# EAGLE schematic E-P-206-R1.2 Fuel Cell Control (Board to Board) (EAGLE 7.4.0)

## Sheet 1 of 4: Connectors
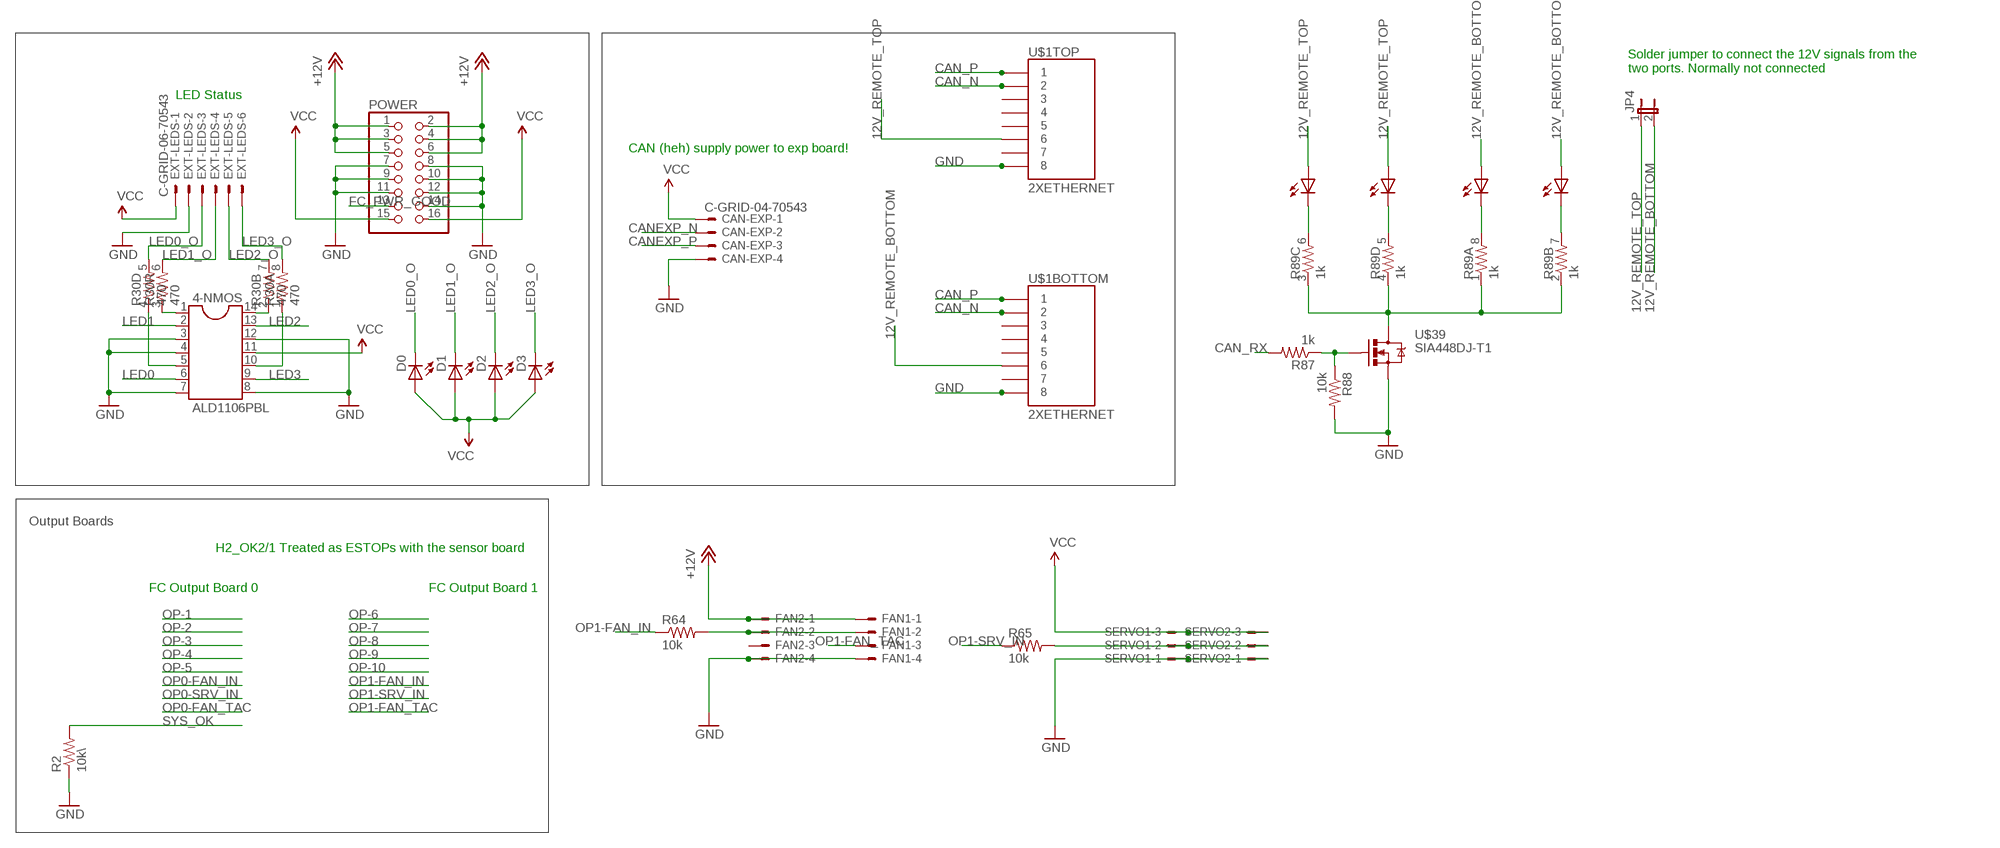
[diagram p0: schematic, sheet 1]

### Parts
4-NMOS  ALD1106PBL  DIL14SOIC  [SOIC-14]
CAN-EXP  C-GRID-04-70543  [70543-04]
D0  LED1206  [LED-1206]
D1  LED1206  [LED-1206]
D2  LED1206  [LED-1206]
D3  LED1206  [LED-1206]
EXT-LEDS  C-GRID-06-70543  [70543-06]
FAN1  C-GRID-04-70543  [70543-04]
FAN2  C-GRID-04-70543  [70543-04]
JP4  JUMPER-2SMD-NO  [SJ_2S-NO]
POWER  PINHD-2X8  [2X08]
R2  10k\  RESISTOR0603-RES  [0603-RES]
R30  470  RESISTOR-ARRAY0603-ARV  [0603-ARV]
R64  10k  RESISTOR0603-RES  [0603-RES]
R65  10k  RESISTOR0603-RES  [0603-RES]
R87  1k  RESISTOR0603-RES  [0603-RES]
R88  10k  RESISTOR0603-RES  [0603-RES]
R89  1k  RESISTOR-ARRAY0603-ARV  [0603-ARV]
SERVO1  C-GRID-03-70543  [70543-03]
SERVO2  C-GRID-03-70543  [70543-03]
U$1  2XETHERNET  [2XETHERNET]
U$39  SIA448DJ-T1  SIA426DJ  [SC70-6L]

### Nets
12V_REMOTE_BOTTOM: JP4.2 U$1.B_6 U$1.B_9(BTM_LED_0:A) U$1.B_11(BTM_LED_1:A)
12V_REMOTE_TOP: JP4.1 U$1.T_6 U$1.T_9(TOP_LED_0:A) U$1.T_11(TOP_LED_1:A)
+12V: FAN1.1 FAN2.1 POWER.1 POWER.2 POWER.3 POWER.4 POWER.5 POWER.6 ; also sheet 2,3,4
CAN_N: U$1.B_2 U$1.T_2 ; also sheet 3
CAN_P: U$1.B_1 U$1.T_1 ; also sheet 3
CAN_RX: R87.2 ; also sheet 3
CANEXP_N: CAN-EXP.2 ; also sheet 3
CANEXP_P: CAN-EXP.3 ; also sheet 3
FC_PWR_GOOD: POWER.13 ; also sheet 3
GND: 4-NMOS.3 4-NMOS.4 4-NMOS.7 4-NMOS.8 4-NMOS.12 CAN-EXP.4 EXT-LEDS.2 FAN1.4 FAN2.4 POWER.7 POWER.8 POWER.9 POWER.10 POWER.11 POWER.12 POWER.14 R2.1 R88.2 SERVO1.1 SERVO2.1 U$1.B_8 U$1.T_8 U$39.S@0(S) U$39.S@1(S) ; also sheet 2,3,4
LED0: 4-NMOS.6 ; also sheet 3
LED0_O: D0.C EXT-LEDS.3 R30.5
LED1: 4-NMOS.2 ; also sheet 3
LED1_O: D1.C EXT-LEDS.4 R30.6
LED2: 4-NMOS.13 ; also sheet 3
LED2_O: D2.C EXT-LEDS.5 R30.7
LED3: 4-NMOS.9 ; also sheet 3
LED3_O: D3.C EXT-LEDS.6 R30.8
N$2: 4-NMOS.5 R30.4
N$4: 4-NMOS.1 R30.3
N$7: 4-NMOS.14 R30.2
N$8: 4-NMOS.10 R30.1
N$15: R89.7 U$1.B_10(BTM_LED_0:C)
N$17: R89.5 U$1.T_12(TOP_LED_1:C)
N$18: R87.1 R88.1 U$39.G
N$19: R89.6 U$1.T_10(TOP_LED_0:C)
N$20: R89.8 U$1.B_12(BTM_LED_1:C)
N$36: FAN1.2 FAN2.2 R64.2
N$37: R65.2 SERVO1.2 SERVO2.2
N$86: R89.1 R89.2 R89.3 R89.4 U$39.D
OP1-FAN_IN: R64.1 ; also sheet 3
OP1-FAN_TAC: FAN1.3 ; also sheet 3
OP1-SRV_IN: R65.1 ; also sheet 3
SYS_OK: R2.2 ; also sheet 2,3
VCC: 4-NMOS.11 CAN-EXP.1 D0.A D1.A D2.A D3.A EXT-LEDS.1 POWER.15 POWER.16 SERVO1.3 SERVO2.3 ; also sheet 2,3
Unconnected: FAN2.3 U$1.B_3 U$1.B_4 U$1.B_5 U$1.B_7 U$1.T_3 U$1.T_4 U$1.T_5 U$1.T_7

### Notes on the sheet
- Solder jumper to connect the 12V signals from the
  two ports. Normally not connected
- LED Status
- CAN (heh) supply power to exp board!
- Output Boards
- H2_OK2/1 Treated as ESTOPs with the sensor board
- FC Output Board 0 | FC Output Board 1

## Sheet 2 of 4: Sensors
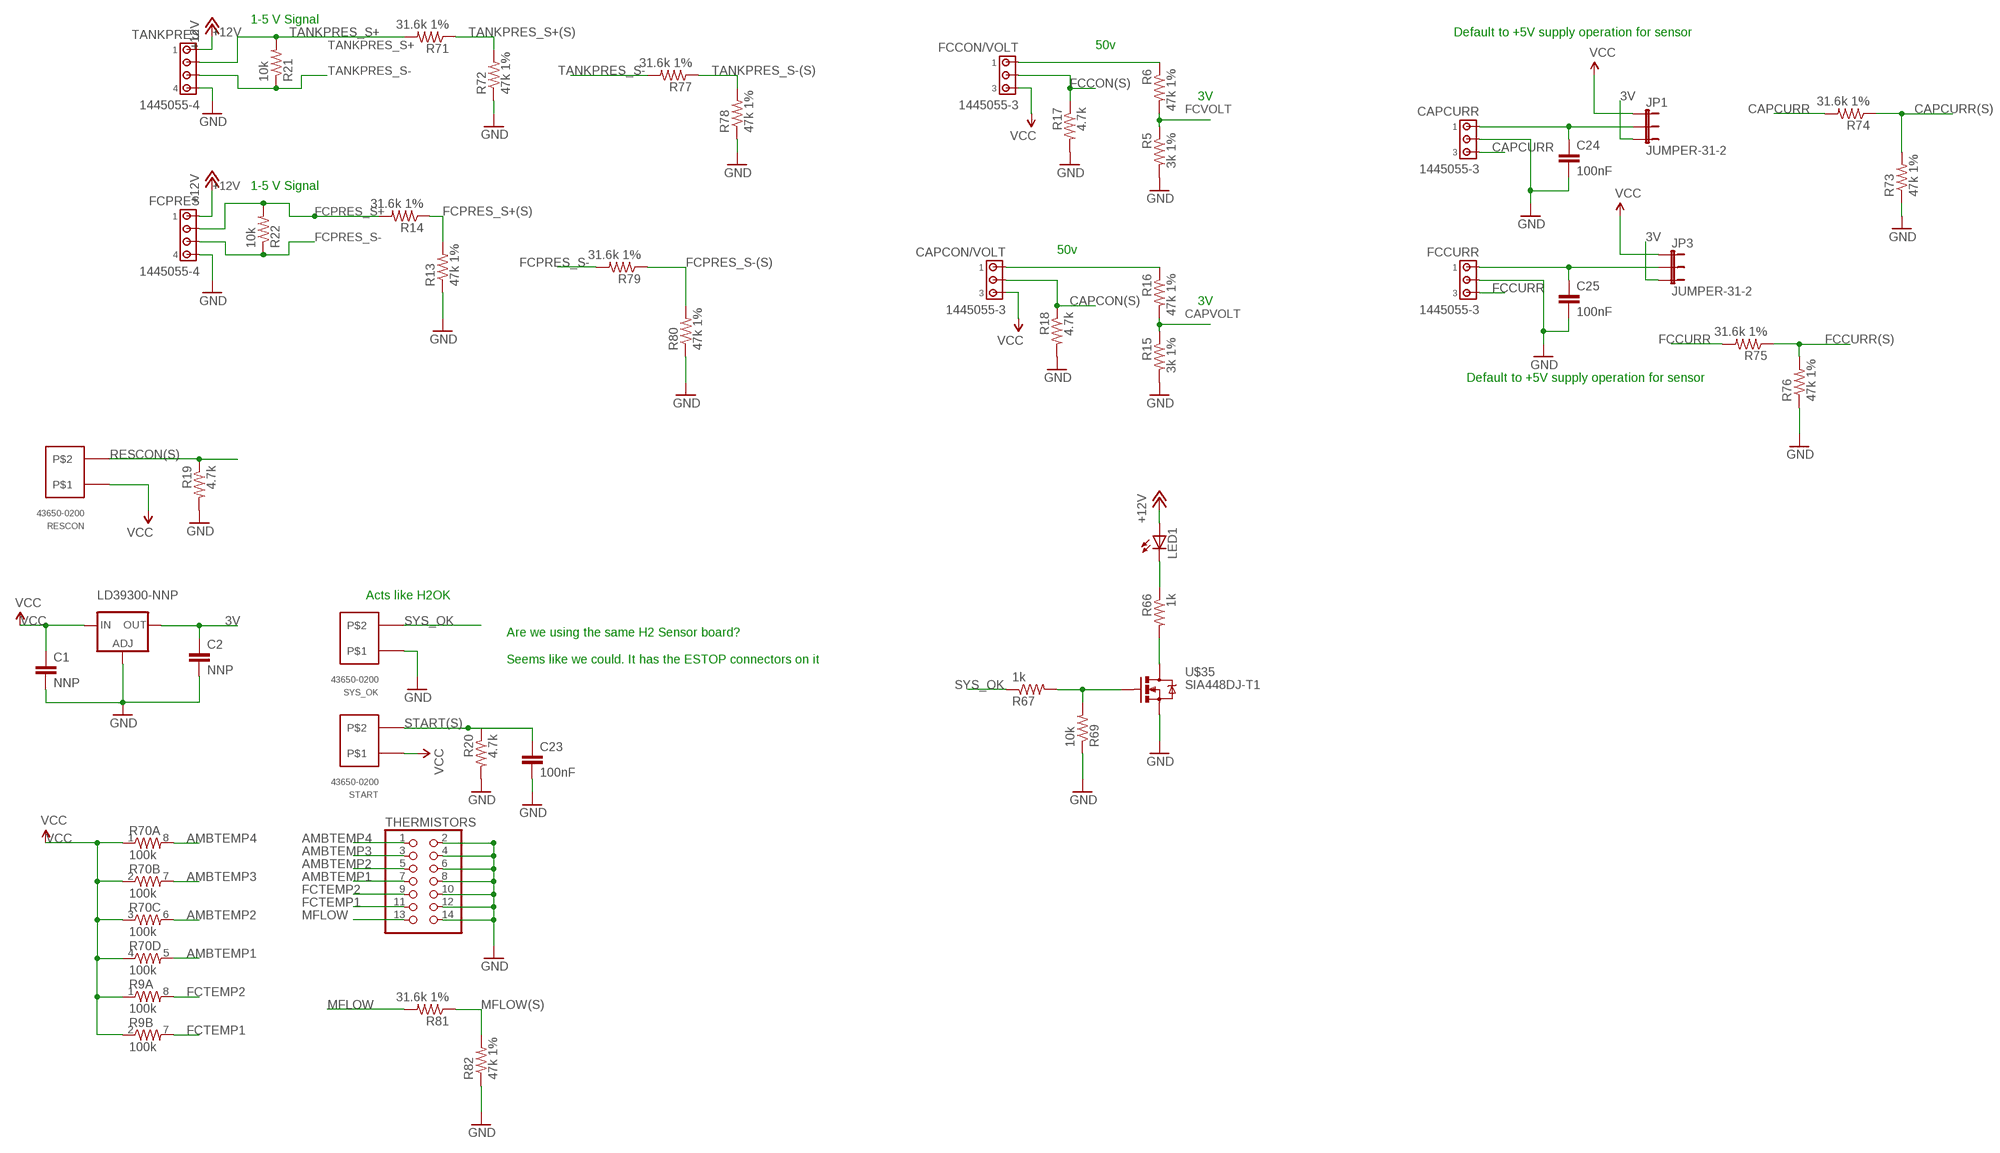
[diagram p1: schematic, sheet 2]

### Parts
C1  NNP  CAP1206  [1206]
C2  NNP  CAP1206  [1206]
C23  100nF  CAP0603-CAP  [0603-CAP]
C24  100nF  CAP0603-CAP  [0603-CAP]
C25  100nF  CAP0603-CAP  [0603-CAP]
CAPCON/VOLT  1445055-3  [1445055-3]
CAPCURR  1445055-3  [1445055-3]
FCCON/VOLT  1445055-3  [1445055-3]
FCCURR  1445055-3  [1445055-3]
FCPRES  1445055-4  [1445055-4]
JP1  JUMPER-31-2  [SJ_3_PASTE1&2]
JP3  JUMPER-31-2  [SJ_3_PASTE1&2]
LD39300-NNP  LD117ADT50TR  [DPACK]
LED1  LED1206  [LED-1206]
R5  3k 1%  RESISTOR0603-RES  [0603-RES]
R6  47k 1%  RESISTOR0603-RES  [0603-RES]
R9  100k  RESISTOR-ARRAY0603-ARV  [0603-ARV]
R13  47k 1%  RESISTOR0603-RES  [0603-RES]
R14  31.6k 1%  RESISTOR0603-RES  [0603-RES]
R15  3k 1%  RESISTOR0603-RES  [0603-RES]
R16  47k 1%  RESISTOR0603-RES  [0603-RES]
R17  4.7k  RESISTOR0603-RES  [0603-RES]
R18  4.7k  RESISTOR0603-RES  [0603-RES]
R19  4.7k  RESISTOR0603-RES  [0603-RES]
R20  4.7k  RESISTOR0603-RES  [0603-RES]
R21  10k  RESISTOR0603-RES  [0603-RES]
R22  10k  RESISTOR0603-RES  [0603-RES]
R66  1k  RESISTOR0603-RES  [0603-RES]
R67  1k  RESISTOR0603-RES  [0603-RES]
R69  10k  RESISTOR0603-RES  [0603-RES]
R70  100k  RESISTOR-ARRAY0603-ARV  [0603-ARV]
R71  31.6k 1%  RESISTOR0603-RES  [0603-RES]
R72  47k 1%  RESISTOR0603-RES  [0603-RES]
R73  47k 1%  RESISTOR0603-RES  [0603-RES]
R74  31.6k 1%  RESISTOR0603-RES  [0603-RES]
R75  31.6k 1%  RESISTOR0603-RES  [0603-RES]
R76  47k 1%  RESISTOR0603-RES  [0603-RES]
R77  31.6k 1%  RESISTOR0603-RES  [0603-RES]
R78  47k 1%  RESISTOR0603-RES  [0603-RES]
R79  31.6k 1%  RESISTOR0603-RES  [0603-RES]
R80  47k 1%  RESISTOR0603-RES  [0603-RES]
R81  31.6k 1%  RESISTOR0603-RES  [0603-RES]
R82  47k 1%  RESISTOR0603-RES  [0603-RES]
RESCON  43650-0200  [43650-0200]
START  43650-0200  [43650-0200]
SYS_OK  43650-0200  [43650-0200]
TANKPRES  1445055-4  [1445055-4]
THERMISTORS  PINHD-2X7  [2X07]
U$35  SIA448DJ-T1  SIA426DJ  [SC70-6L]

### Nets
3V: C2.1 JP1.3 JP3.3 LD39300-NNP.4(OUT)
+12V: FCPRES.1 LED1.A TANKPRES.1 ; also sheet 1,3,4
AMBTEMP1: R70.5 THERMISTORS.7 ; also sheet 3
AMBTEMP2: R70.6 THERMISTORS.5 ; also sheet 3
AMBTEMP3: R70.7 THERMISTORS.3 ; also sheet 3
AMBTEMP4: R70.8 THERMISTORS.1 ; also sheet 3
CAPCON(S): CAPCON/VOLT.2 R18.1 ; also sheet 3
CAPCURR: CAPCURR.3 R74.2
CAPCURR(S): R73.2 R74.1 ; also sheet 3
CAPVOLT: R15.1 R16.2 ; also sheet 3
FCCON(S): FCCON/VOLT.2 R17.1 ; also sheet 3
FCCURR: FCCURR.3 R75.2
FCCURR(S): R75.1 R76.2 ; also sheet 3
FCPRES_S+: FCPRES.2 R14.2 R22.2
FCPRES_S+(S): R13.2 R14.1 ; also sheet 3
FCPRES_S-: FCPRES.3 R22.1 R79.2
FCPRES_S-(S): R79.1 R80.2 ; also sheet 3
FCTEMP1: R9.7 THERMISTORS.11 ; also sheet 3
FCTEMP2: R9.8 THERMISTORS.9 ; also sheet 3
FCVOLT: R5.1 R6.2 ; also sheet 3
FCVOLT+: FCCON/VOLT.1 R6.1
FCVOLT+1: CAPCON/VOLT.1 R16.1
GND: C1.2 C2.2 C23.2 C24.2 C25.2 CAPCURR.2 FCCURR.2 FCPRES.4 LD39300-NNP.1(ADJ) R5.2 R13.1 R15.2 R17.2 R18.2 R19.2 R20.2 R69.1 R72.1 R73.1 R76.1 R78.1 R80.1 R82.1 SYS_OK.P$2 TANKPRES.4 THERMISTORS.2 THERMISTORS.4 THERMISTORS.6 THERMISTORS.8 THERMISTORS.10 THERMISTORS.12 THERMISTORS.14 U$35.S@0(S) U$35.S@1(S) ; also sheet 1,3,4
MFLOW: R81.2 THERMISTORS.13
MFLOW(S): R81.1 R82.2 ; also sheet 3
N$54: R66.2 U$35.D
N$62: R67.2 R69.2 U$35.G
N$70: LED1.C R66.1
N$74: C24.1 CAPCURR.1 JP1.2
N$78: C25.1 FCCURR.1 JP3.2
RESCON(S): R19.1 RESCON.P$1 ; also sheet 3
START(S): C23.1 R20.1 START.P$1 ; also sheet 3
SYS_OK: R67.1 SYS_OK.P$1 ; also sheet 1,3
TANKPRES_S+: R21.2 R71.2 TANKPRES.2
TANKPRES_S+(S): R71.1 R72.2 ; also sheet 3
TANKPRES_S-: R21.1 R77.2 TANKPRES.3
TANKPRES_S-(S): R77.1 R78.2 ; also sheet 3
VCC: C1.1 CAPCON/VOLT.3 FCCON/VOLT.3 JP1.1 JP3.1 LD39300-NNP.3(IN) R9.1 R9.2 R70.1 R70.2 R70.3 R70.4 RESCON.P$2 START.P$2 ; also sheet 1,3
Unconnected: R9.3 R9.4 R9.5 R9.6

### Notes on the sheet
- 1-5 V Signal
- Default to +5V supply operation for sensor
- 50v
- 3V
- 1-5 V Signal
- 50v
- 3V
- Default to +5V supply operation for sensor
- Acts like H2OK
- Are we using the same H2 Sensor board? 
  
  Seems like we could. It has the ESTOP connectors on it

## Sheet 3 of 4: MCU
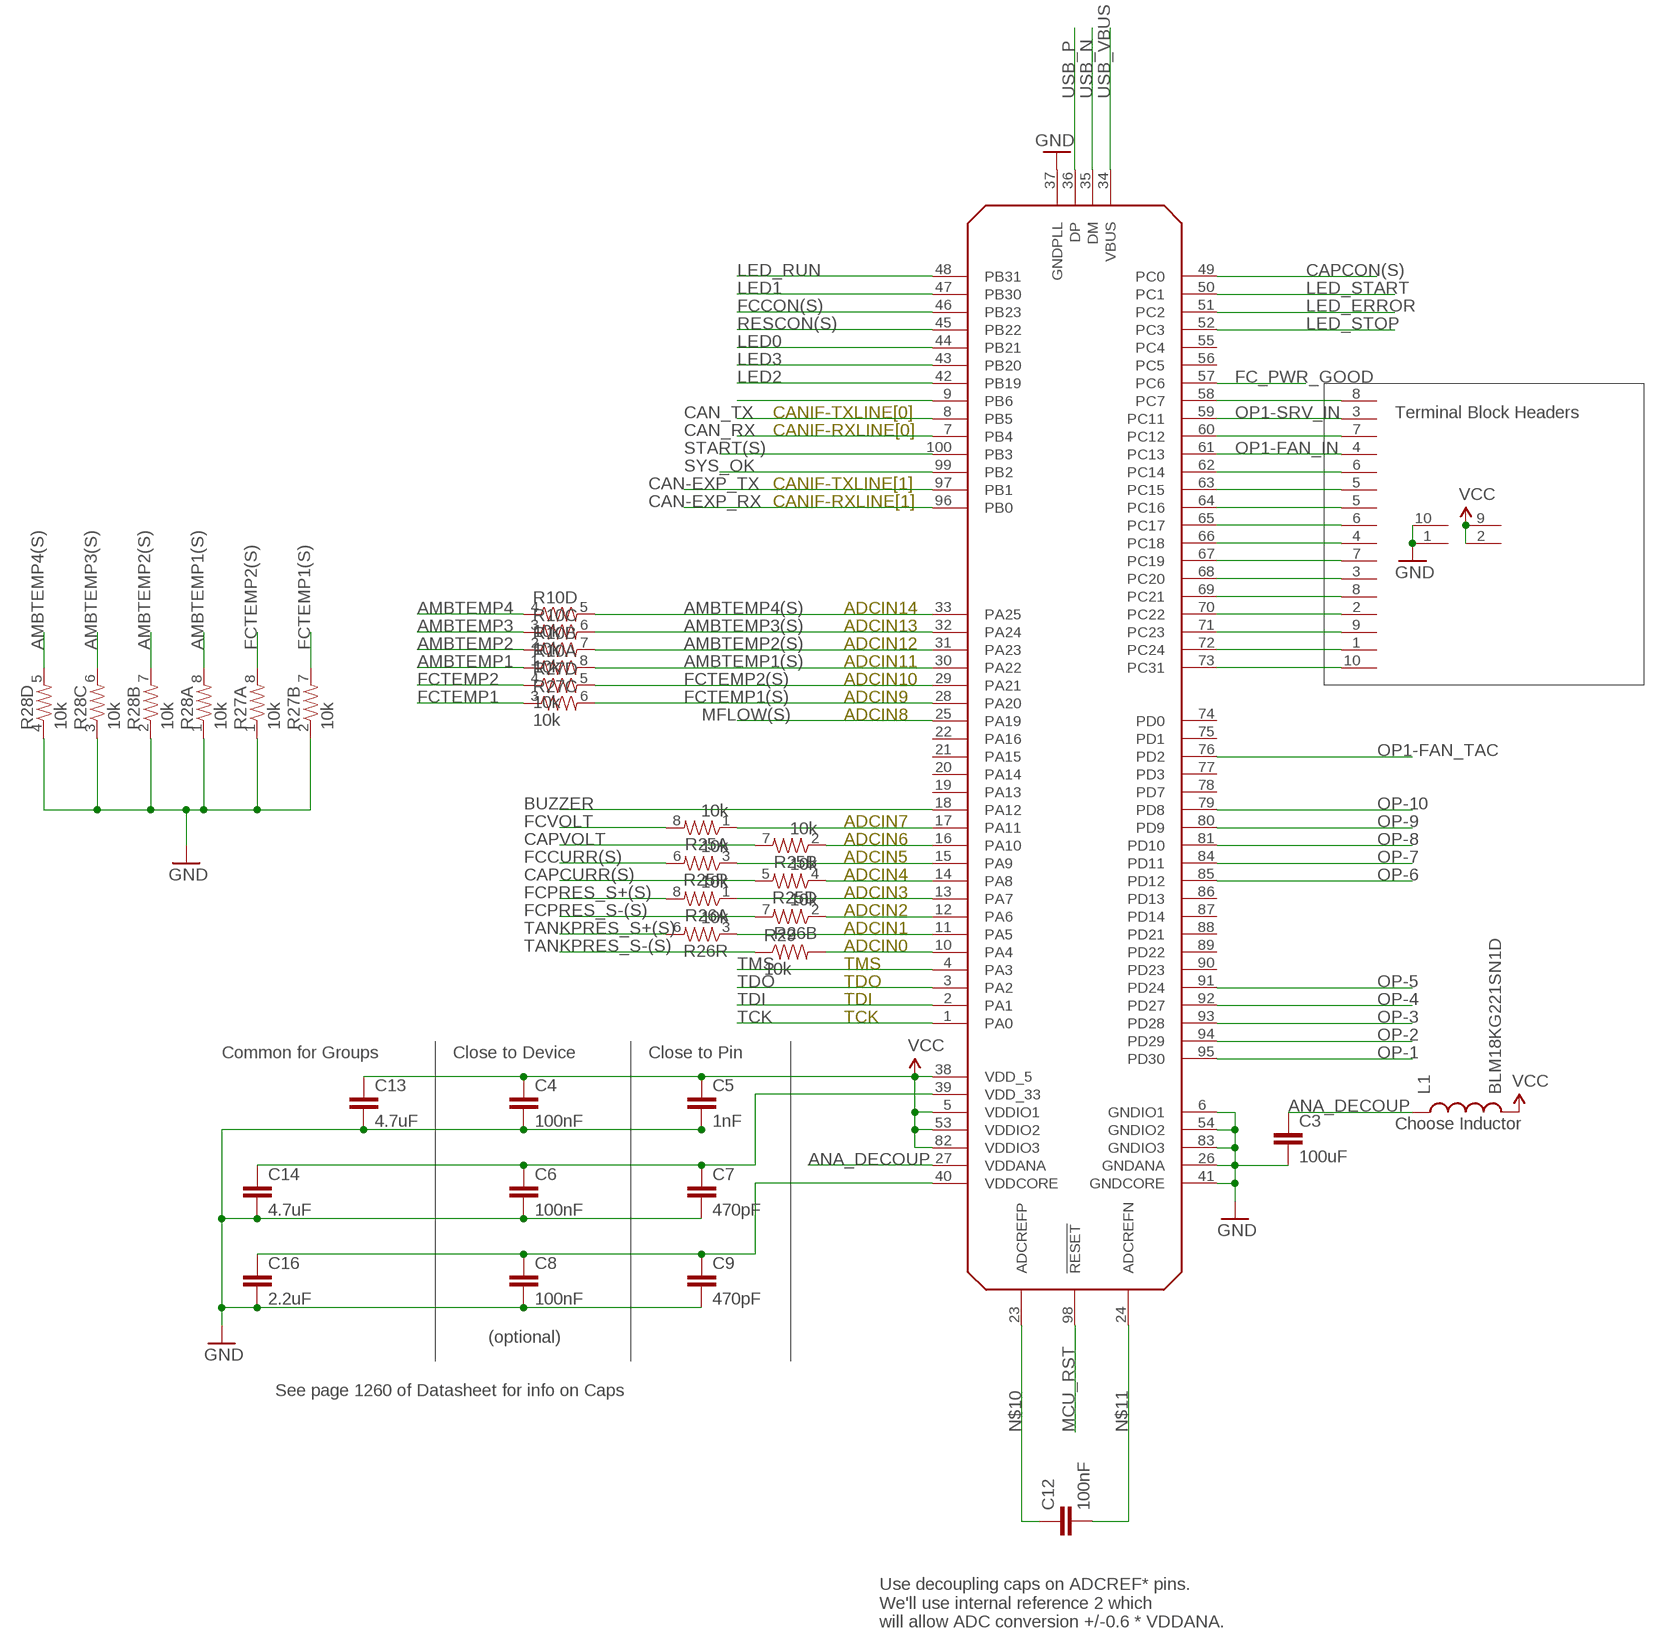
[diagram p2: schematic, sheet 3, part 1 of 2]
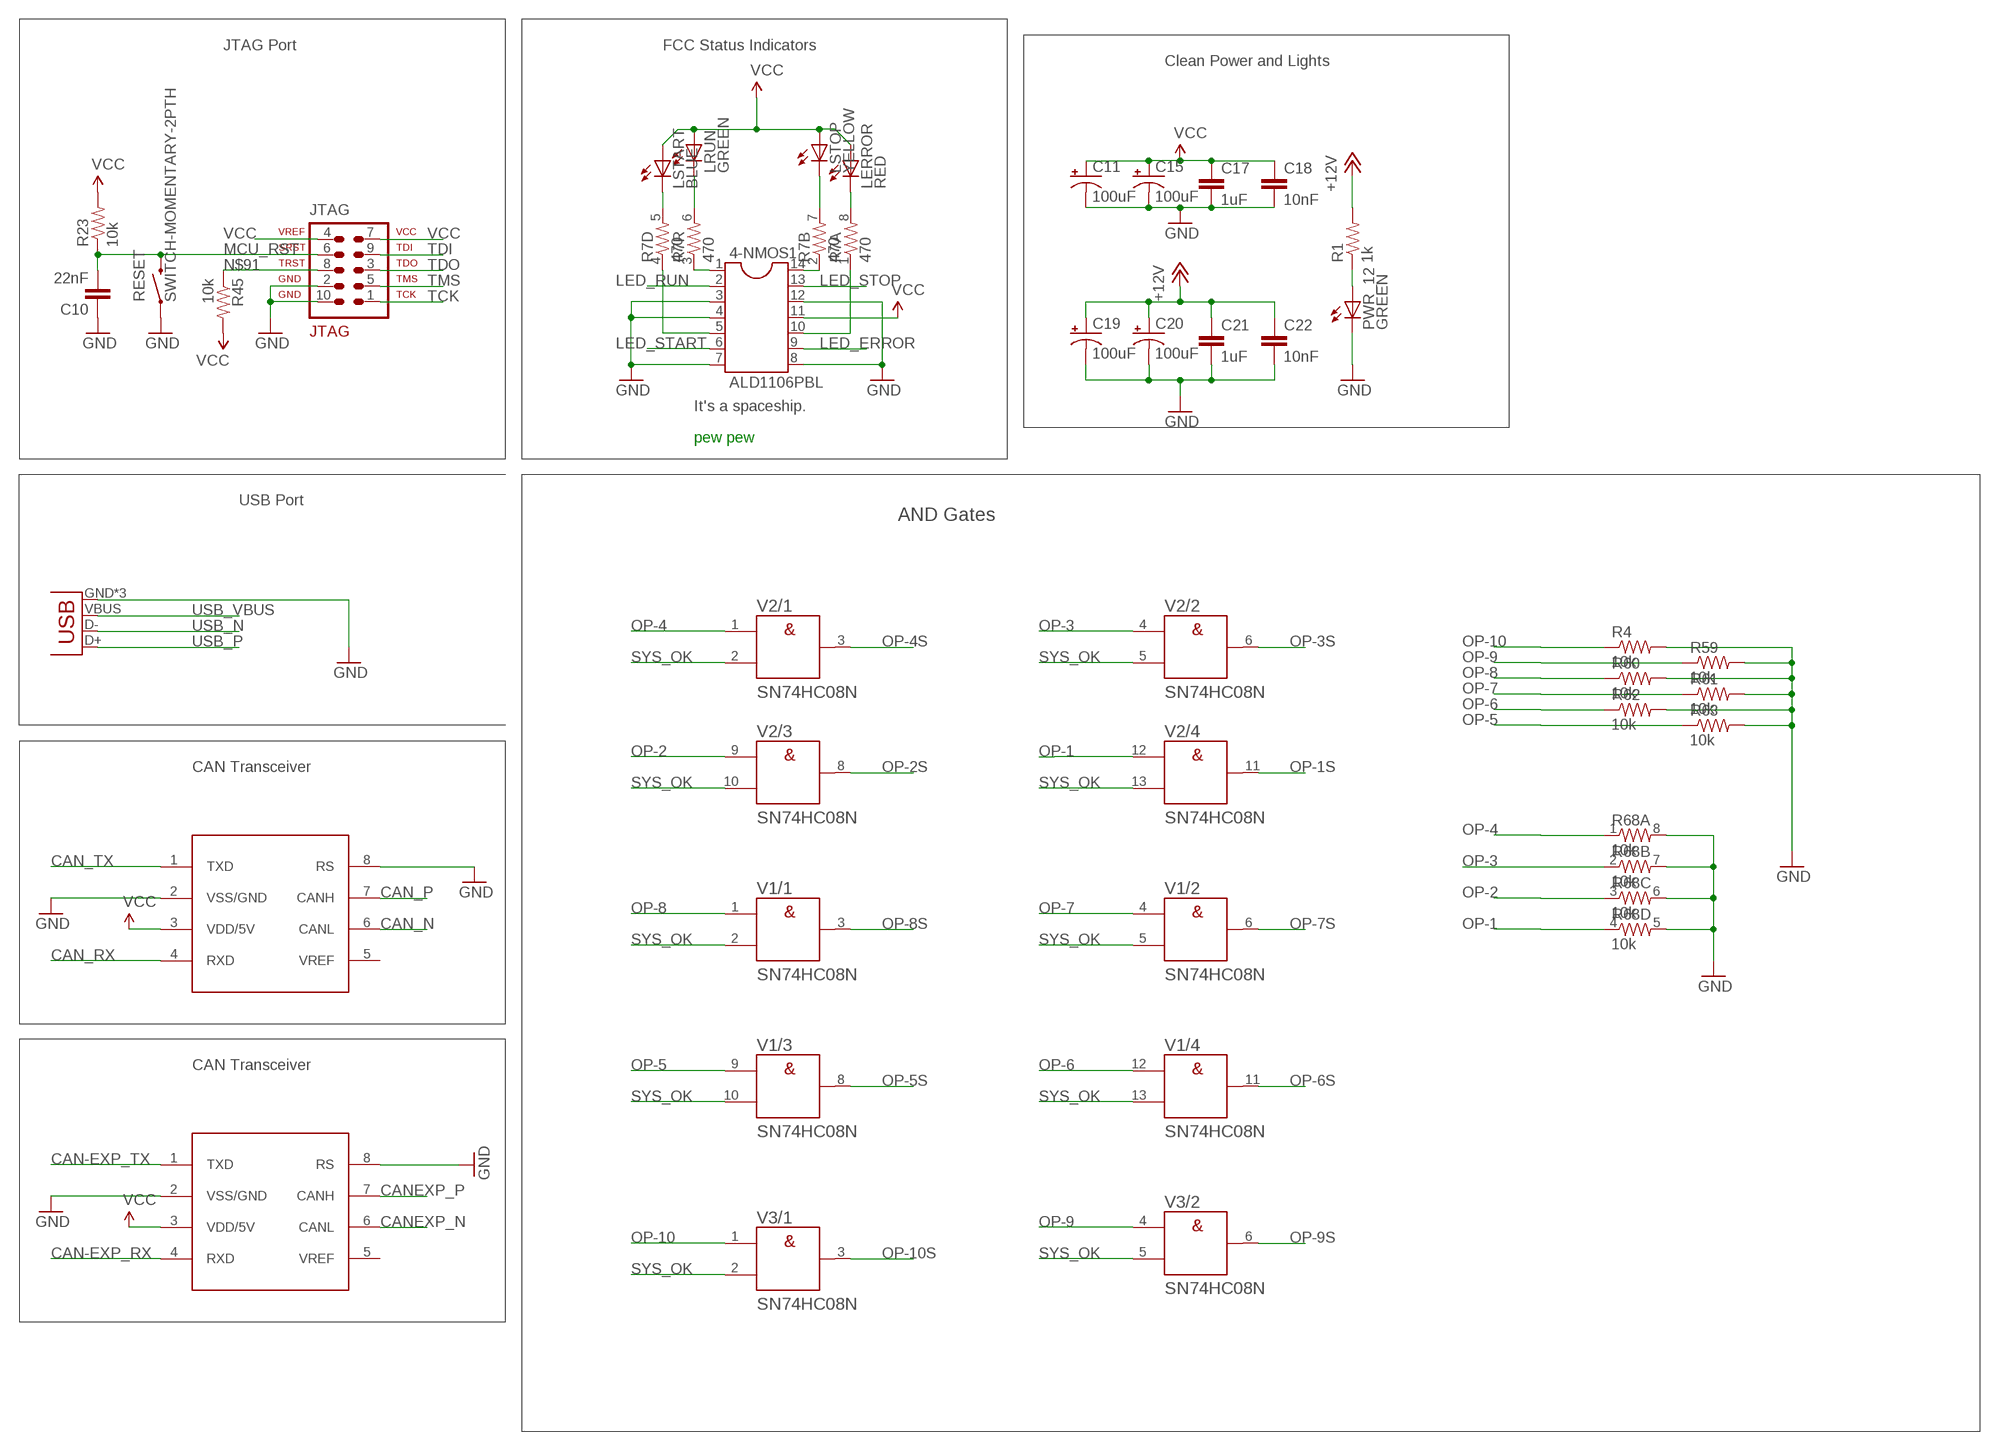
[diagram p3: schematic, sheet 3, part 2 of 2]

### Parts
4-NMOS1  ALD1106PBL  DIL14SOIC  [SOIC-14]
C3  100uF  CAP0805  [0805]
C4  100nF  CAP0603-CAP  [0603-CAP]
C5  1nF  CAP0603-CAP  [0603-CAP]
C6  100nF  CAP0603-CAP  [0603-CAP]
C7  470pF  CAP0603-CAP  [0603-CAP]
C8  100nF  CAP0603-CAP  [0603-CAP]
C9  470pF  CAP0603-CAP  [0603-CAP]
C10  22nF  CAP0603-CAP  [0603-CAP]
C11  100uF  CAP_POLC  [PANASONIC_C]
C12  100nF  CAP0805  [0805]
C13  4.7uF  CAP0805  [0805]
C14  4.7uF  CAP0805  [0805]
C15  100uF  CAP_POLC  [PANASONIC_C]
C16  2.2uF  CAP0805  [0805]
C17  1uF  CAP0805  [0805]
C18  10nF  CAP0603-CAP  [0603-CAP]
C19  100uF  CAP_POLC  [PANASONIC_C]
C20  100uF  CAP_POLC  [PANASONIC_C]
C21  1uF  CAP0805  [0805]
C22  10nF  CAP0603-CAP  [0603-CAP]
JP2  USB  USB-MICROB  [USB-MICROB]
JTAG  2x5  AVR-JTAG-10  [AVR-JTAG-10]
L1  BLM18KG221SN1D  INDUCTOR0603  [0603]
LERROR  RED  LED1206  [LED-1206]
LRUN  GREEN  LED1206  [LED-1206]
LSTART  BLUE  LED1206  [LED-1206]
LSTOP  YELLOW  LED1206  [LED-1206]
MCU  AT32UC3C1512  [TQFP100]
PWR_12  GREEN  LED1206  [LED-1206]
R1  1k  RESISTOR0603-RES  [0603-RES]
R4  10k  RESISTOR0603-RES  [0603-RES]
R7  470  RESISTOR-ARRAY0603-ARV  [0603-ARV]
R10  10k  RESISTOR-ARRAY0603-ARV  [0603-ARV]
R23  10k  RESISTOR0603-RES  [0603-RES]
R25  10k  RESISTOR-ARRAY0603-ARV  [0603-ARV]
R26  10k  RESISTOR-ARRAY0603-ARV  [0603-ARV]
R27  10k  RESISTOR-ARRAY0603-ARV  [0603-ARV]
R28  10k  RESISTOR-ARRAY0603-ARV  [0603-ARV]
R29  10k  RESISTOR0603-RES  [0603-RES]
R45  10k  RESISTOR0603-RES  [0603-RES]
R59  10k  RESISTOR0603-RES  [0603-RES]
R60  10k  RESISTOR0603-RES  [0603-RES]
R61  10k  RESISTOR0603-RES  [0603-RES]
R62  10k  RESISTOR0603-RES  [0603-RES]
R63  10k  RESISTOR0603-RES  [0603-RES]
R68  10k  RESISTOR-ARRAY0603-ARV  [0603-ARV]
RESET  SWITCH-MOMENTARY-2PTH  [TACTILE-PTH]
U$2  10X1PCBBLOCK  [10X1PCBBLOCK]
U$3  10X1PCBBLOCK  [10X1PCBBLOCK]
U$4  MCP2551  MCP2551SOIC  [8-SOIC]
U$36  MCP2551  MCP2551SOIC  [8-SOIC]
V1  SN74HC08N  7408N  [DIL14]
V2  SN74HC08N  7408N  [DIL14]
V3  SN74HC08N  7408N  [DIL14]

### Nets
+12V: C19.+ C20.+ C21.1 C22.1 R1.2 ; also sheet 1,2,4
AMBTEMP1: R10.1 ; also sheet 2
AMBTEMP1(S): MCU.30(PA22) R10.8 R28.8
AMBTEMP2: R10.2 ; also sheet 2
AMBTEMP2(S): MCU.31(PA23) R10.7 R28.7
AMBTEMP3: R10.3 ; also sheet 2
AMBTEMP3(S): MCU.32(PA24) R10.6 R28.6
AMBTEMP4: R10.4 ; also sheet 2
AMBTEMP4(S): MCU.33(PA25) R10.5 R28.5
ANA_DECOUP: C3.1 L1.1 MCU.27(VDDANA)
BUZZER: MCU.18(PA12) ; also sheet 4
CAN-EXP_RX: MCU.96(PB0) U$36.4(RXD)
CAN-EXP_TX: MCU.97(PB1) U$36.1(TXD)
CAN_N: U$4.6(CANL) ; also sheet 1
CAN_P: U$4.7(CANH) ; also sheet 1
CAN_RX: MCU.7(PB4) U$4.4(RXD) ; also sheet 1
CAN_TX: MCU.8(PB5) U$4.1(TXD)
CANEXP_N: U$36.6(CANL) ; also sheet 1
CANEXP_P: U$36.7(CANH) ; also sheet 1
CAPCON(S): MCU.49(PC0) ; also sheet 2
CAPCURR(S): R25.5 ; also sheet 2
CAPVOLT: R25.7 ; also sheet 2
FC_PWR_GOOD: MCU.57(PC6) ; also sheet 1
FCCON(S): MCU.46(PB23) ; also sheet 2
FCCURR(S): R25.6 ; also sheet 2
FCPRES_S+(S): R26.8 ; also sheet 2
FCPRES_S-(S): R26.7 ; also sheet 2
FCTEMP1: R27.3 ; also sheet 2
FCTEMP1(S): MCU.28(PA20) R27.6 R27.7
FCTEMP2: R27.4 ; also sheet 2
FCTEMP2(S): MCU.29(PA21) R27.5 R27.8
FCVOLT: R25.8 ; also sheet 2
GND: 4-NMOS1.3 4-NMOS1.4 4-NMOS1.7 4-NMOS1.8 4-NMOS1.12 C3.2 C4.2 C5.2 C6.2 C7.2 C8.2 C9.2 C10.1 C11.- C13.2 C14.2 C15.- C16.2 C17.2 C18.2 C19.- C20.- C21.2 C22.2 JP2.GND JP2.MT1(GND) JP2.MT2(GND) JTAG.2 JTAG.10 MCU.6(GNDIO1) MCU.26(GNDANA) MCU.37(GNDPLL) MCU.41(GNDCORE) MCU.54(GNDIO2) MCU.83(GNDIO3) PWR_12.C R4.2 R27.1 R27.2 R28.1 R28.2 R28.3 R28.4 R59.2 R60.2 R61.2 R62.2 R63.2 R68.5 R68.6 R68.7 R68.8 RESET.1 U$2.10 U$3.1 U$4.2(VSS/GND) U$4.8(RS) U$36.2(VSS/GND) U$36.8(RS) ; also sheet 1,2,4
LED0: MCU.44(PB21) ; also sheet 1
LED1: MCU.47(PB30) ; also sheet 1
LED2: MCU.42(PB19) ; also sheet 1
LED3: MCU.43(PB20) ; also sheet 1
LED_ERROR: 4-NMOS1.9 MCU.51(PC2)
LED_RUN: 4-NMOS1.2 MCU.48(PB31)
LED_START: 4-NMOS1.6 MCU.50(PC1)
LED_STOP: 4-NMOS1.13 MCU.52(PC3)
MCU_RST: C10.2 JTAG.6 MCU.98(!RESET) R23.1 RESET.3
MFLOW(S): MCU.25(PA19) ; also sheet 2
N$1: MCU.10(PA4) R29.2
N$3: MCU.12(PA6) R26.2
N$5: MCU.13(PA7) R26.1
N$6: C6.1 C7.1 C14.1 MCU.39(VDD_33)
N$9: C8.1 C9.1 C16.1 MCU.40(VDDCORE)
N$10: C12.1 MCU.23(ADCREFP)
N$11: C12.2 MCU.24(ADCREFN)
N$12: MCU.72(PC24) U$2.1
N$13: MCU.11(PA5) R26.3
N$14: MCU.70(PC22) U$2.2
N$16: MCU.68(PC20) U$2.3
N$21: MCU.14(PA8) R25.4
N$22: MCU.66(PC18) U$2.4
N$23: MCU.64(PC16) U$2.5
N$24: MCU.62(PC14) U$2.6
N$25: LSTART.C R7.5
N$26: LRUN.C R7.6
N$27: MCU.15(PA9) R25.3
N$28: MCU.16(PA10) R25.2
N$29: MCU.17(PA11) R25.1
N$30: MCU.60(PC12) U$2.7
N$31: MCU.58(PC7) U$2.8
N$32: 4-NMOS1.5 R7.4
N$33: 4-NMOS1.1 R7.3
N$34: PWR_12.A R1.1
N$38: MCU.63(PC15) U$3.5
N$39: MCU.65(PC17) U$3.6
N$40: MCU.67(PC19) U$3.7
N$41: MCU.69(PC21) U$3.8
N$42: MCU.71(PC23) U$3.9
N$43: MCU.73(PC31) U$3.10
N$44: 4-NMOS1.14 R7.2
N$45: 4-NMOS1.10 R7.1
N$46: LSTOP.C R7.7
N$47: LERROR.C R7.8
N$66: MCU.9(PB6)
N$91: JTAG.8 R45.1
OP1-FAN_IN: MCU.61(PC13) U$3.4 ; also sheet 1
OP1-FAN_TAC: MCU.76(PD2) ; also sheet 1
OP1-SRV_IN: MCU.59(PC11) U$3.3 ; also sheet 1
OP-1: MCU.95(PD30) R68.4 V2.12(/4:A) ; also sheet 1
OP-1S: V2.11(/4:Y) ; also sheet 4
OP-2: MCU.94(PD29) R68.3 V2.9(/3:A) ; also sheet 1
OP-2S: V2.8(/3:Y) ; also sheet 4
OP-3: MCU.93(PD28) R68.2 V2.4(/2:A) ; also sheet 1
OP-3S: V2.6(/2:Y) ; also sheet 4
OP-4: MCU.92(PD27) R68.1 V2.1(/1:A) ; also sheet 1
OP-4S: V2.3(/1:Y) ; also sheet 4
OP-5: MCU.91(PD24) R63.1 V1.9(/3:A) ; also sheet 1
OP-5S: V1.8(/3:Y) ; also sheet 4
OP-6: MCU.85(PD12) R62.1 V1.12(/4:A) ; also sheet 1
OP-6S: V1.11(/4:Y) ; also sheet 4
OP-7: MCU.84(PD11) R61.1 V1.4(/2:A) ; also sheet 1
OP-7S: V1.6(/2:Y) ; also sheet 4
OP-8: MCU.81(PD10) R60.1 V1.1(/1:A) ; also sheet 1
OP-8S: V1.3(/1:Y) ; also sheet 4
OP-9: MCU.80(PD9) R59.1 V3.4(/2:A) ; also sheet 1
OP-9S: V3.6(/2:Y) ; also sheet 4
OP-10: MCU.79(PD8) R4.1 V3.1(/1:A) ; also sheet 1
OP-10S: V3.3(/1:Y) ; also sheet 4
RESCON(S): MCU.45(PB22) ; also sheet 2
START(S): MCU.100(PB3) ; also sheet 2
SYS_OK: MCU.99(PB2) V1.2(/1:B) V1.5(/2:B) V1.10(/3:B) V1.13(/4:B) V2.2(/1:B) V2.5(/2:B) V2.10(/3:B) V2.13(/4:B) V3.2(/1:B) V3.5(/2:B) ; also sheet 1,2
TANKPRES_S+(S): R26.6 ; also sheet 2
TANKPRES_S-(S): R29.1 ; also sheet 2
TCK: JTAG.1 MCU.1(PA0)
TDI: JTAG.9 MCU.2(PA1)
TDO: JTAG.3 MCU.3(PA2)
TMS: JTAG.5 MCU.4(PA3)
USB_N: JP2.D- MCU.35(DM)
USB_P: JP2.D+ MCU.36(DP)
USB_VBUS: JP2.VBUS MCU.34(VBUS)
VCC: 4-NMOS1.11 C4.1 C5.1 C11.+ C13.1 C15.+ C17.1 C18.1 JTAG.4 JTAG.7 L1.2 LERROR.A LRUN.A LSTART.A LSTOP.A MCU.5(VDDIO1) MCU.38(VDD_5) MCU.53(VDDIO2) MCU.82(VDDIO3) R23.2 R45.2 U$2.9 U$3.2 U$4.3(VDD/5V) U$36.3(VDD/5V) ; also sheet 1,2
Unconnected: MCU.19(PA13) MCU.20(PA14) MCU.21(PA15) MCU.22(PA16) MCU.55(PC4) MCU.56(PC5) MCU.74(PD0) MCU.75(PD1) MCU.77(PD3) MCU.78(PD7) MCU.86(PD13) MCU.87(PD14) MCU.88(PD21) MCU.89(PD22) MCU.90(PD23) R26.4 R26.5 U$4.5(VREF) U$36.5(VREF) V3.8(/3:Y) V3.9(/3:A) V3.10(/3:B) V3.11(/4:Y) V3.12(/4:A) V3.13(/4:B)

### Notes on the sheet
- JTAG Port | FCC Status Indicators
- Clean Power and Lights
- CANIF-TXLINE[0] | Terminal Block Headers
- CANIF-RXLINE[0]
- It's a spaceship.
- CANIF-TXLINE[1] | pew pew
- CANIF-RXLINE[1]
- USB Port
- AND Gates
- ADCIN14
- ADCIN13
- ADCIN12
- ADCIN11
- ADCIN10
- ADCIN9
- ADCIN8
- ADCIN7
- ADCIN6
- ADCIN5 | CAN Transceiver
- ADCIN4
- ADCIN3
- ADCIN2
- ADCIN1
- ADCIN0
- TMS
- TDO
- TDI
- TCK
- Common for Groups | Close to Device | Close to Pin
- Choose Inductor
- CAN Transceiver
- (optional)
- See page 1260 of Datasheet for info on Caps
- Use decoupling caps on ADCREF* pins.
  We'll use internal reference 2 which 
  will allow ADC conversion +/-0.6 * VDDANA.

## Sheet 4 of 4: Output Drivers
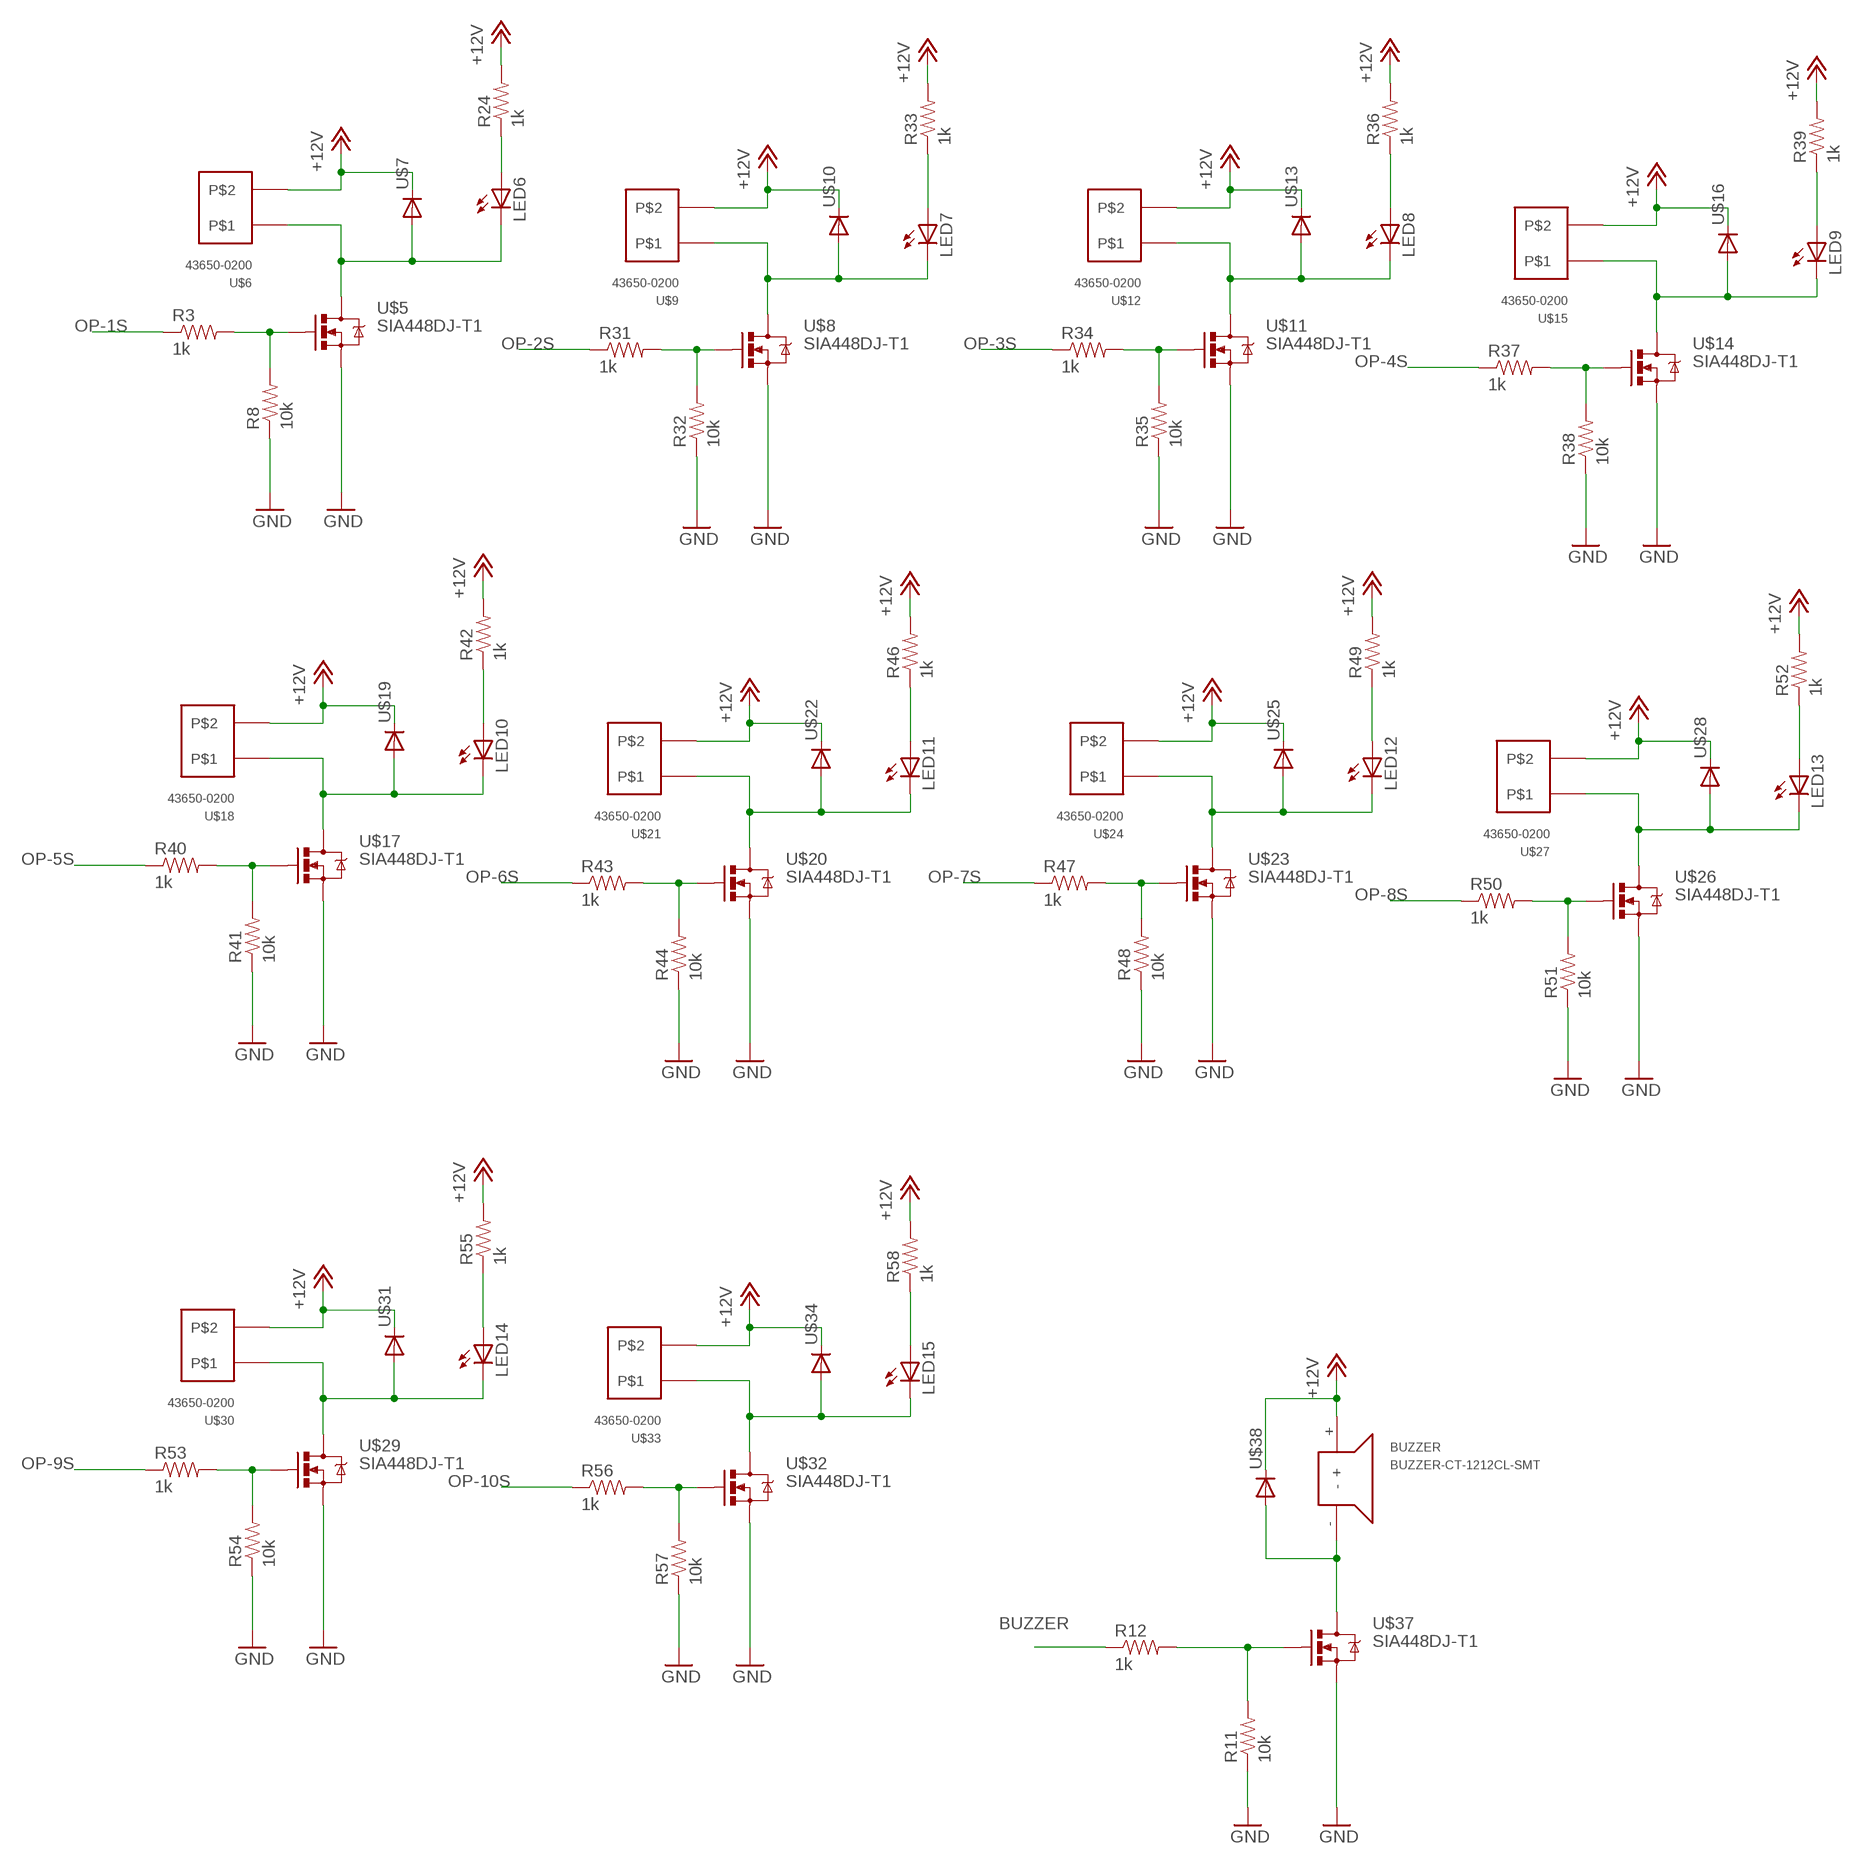
[diagram p4: schematic, sheet 4]

### Parts
BUZZER  BUZZER-CT-1212CL-SMT  [CT-1212CL-SMT]
LED6  LED1206  [LED-1206]
LED7  LED1206  [LED-1206]
LED8  LED1206  [LED-1206]
LED9  LED1206  [LED-1206]
LED10  LED1206  [LED-1206]
LED11  LED1206  [LED-1206]
LED12  LED1206  [LED-1206]
LED13  LED1206  [LED-1206]
LED14  LED1206  [LED-1206]
LED15  LED1206  [LED-1206]
R3  1k  RESISTOR0603-RES  [0603-RES]
R8  10k  RESISTOR0603-RES  [0603-RES]
R11  10k  RESISTOR0603-RES  [0603-RES]
R12  1k  RESISTOR0603-RES  [0603-RES]
R24  1k  RESISTOR0603-RES  [0603-RES]
R31  1k  RESISTOR0603-RES  [0603-RES]
R32  10k  RESISTOR0603-RES  [0603-RES]
R33  1k  RESISTOR0603-RES  [0603-RES]
R34  1k  RESISTOR0603-RES  [0603-RES]
R35  10k  RESISTOR0603-RES  [0603-RES]
R36  1k  RESISTOR0603-RES  [0603-RES]
R37  1k  RESISTOR0603-RES  [0603-RES]
R38  10k  RESISTOR0603-RES  [0603-RES]
R39  1k  RESISTOR0603-RES  [0603-RES]
R40  1k  RESISTOR0603-RES  [0603-RES]
R41  10k  RESISTOR0603-RES  [0603-RES]
R42  1k  RESISTOR0603-RES  [0603-RES]
R43  1k  RESISTOR0603-RES  [0603-RES]
R44  10k  RESISTOR0603-RES  [0603-RES]
R46  1k  RESISTOR0603-RES  [0603-RES]
R47  1k  RESISTOR0603-RES  [0603-RES]
R48  10k  RESISTOR0603-RES  [0603-RES]
R49  1k  RESISTOR0603-RES  [0603-RES]
R50  1k  RESISTOR0603-RES  [0603-RES]
R51  10k  RESISTOR0603-RES  [0603-RES]
R52  1k  RESISTOR0603-RES  [0603-RES]
R53  1k  RESISTOR0603-RES  [0603-RES]
R54  10k  RESISTOR0603-RES  [0603-RES]
R55  1k  RESISTOR0603-RES  [0603-RES]
R56  1k  RESISTOR0603-RES  [0603-RES]
R57  10k  RESISTOR0603-RES  [0603-RES]
R58  1k  RESISTOR0603-RES  [0603-RES]
U$5  SIA448DJ-T1  SIA426DJ  [SC70-6L]
U$6  43650-0200  [43650-0200]
U$7  DIODE-DO214AC  [DO214AC]
U$8  SIA448DJ-T1  SIA426DJ  [SC70-6L]
U$9  43650-0200  [43650-0200]
U$10  DIODE-DO214AC  [DO214AC]
U$11  SIA448DJ-T1  SIA426DJ  [SC70-6L]
U$12  43650-0200  [43650-0200]
U$13  DIODE-DO214AC  [DO214AC]
U$14  SIA448DJ-T1  SIA426DJ  [SC70-6L]
U$15  43650-0200  [43650-0200]
U$16  DIODE-DO214AC  [DO214AC]
U$17  SIA448DJ-T1  SIA426DJ  [SC70-6L]
U$18  43650-0200  [43650-0200]
U$19  DIODE-DO214AC  [DO214AC]
U$20  SIA448DJ-T1  SIA426DJ  [SC70-6L]
U$21  43650-0200  [43650-0200]
U$22  DIODE-DO214AC  [DO214AC]
U$23  SIA448DJ-T1  SIA426DJ  [SC70-6L]
U$24  43650-0200  [43650-0200]
U$25  DIODE-DO214AC  [DO214AC]
U$26  SIA448DJ-T1  SIA426DJ  [SC70-6L]
U$27  43650-0200  [43650-0200]
U$28  DIODE-DO214AC  [DO214AC]
U$29  SIA448DJ-T1  SIA426DJ  [SC70-6L]
U$30  43650-0200  [43650-0200]
U$31  DIODE-DO214AC  [DO214AC]
U$32  SIA448DJ-T1  SIA426DJ  [SC70-6L]
U$33  43650-0200  [43650-0200]
U$34  DIODE-DO214AC  [DO214AC]
U$37  SIA448DJ-T1  SIA426DJ  [SC70-6L]
U$38  DIODE-DO214AC  [DO214AC]

### Nets
+12V: BUZZER.+ R24.2 R33.2 R36.2 R39.2 R42.2 R46.2 R49.2 R52.2 R55.2 R58.2 U$6.P$1 U$7.C U$9.P$1 U$10.C U$12.P$1 U$13.C U$15.P$1 U$16.C U$18.P$1 U$19.C U$21.P$1 U$22.C U$24.P$1 U$25.C U$27.P$1 U$28.C U$30.P$1 U$31.C U$33.P$1 U$34.C U$38.C ; also sheet 1,2,3
BUZZER: R12.1 ; also sheet 3
GND: R8.1 R11.1 R32.1 R35.1 R38.1 R41.1 R44.1 R48.1 R51.1 R54.1 R57.1 U$5.S@0(S) U$5.S@1(S) U$8.S@0(S) U$8.S@1(S) U$11.S@0(S) U$11.S@1(S) U$14.S@0(S) U$14.S@1(S) U$17.S@0(S) U$17.S@1(S) U$20.S@0(S) U$20.S@1(S) U$23.S@0(S) U$23.S@1(S) U$26.S@0(S) U$26.S@1(S) U$29.S@0(S) U$29.S@1(S) U$32.S@0(S) U$32.S@1(S) U$37.S@0(S) U$37.S@1(S) ; also sheet 1,2,3
N$35: R3.2 R8.2 U$5.G
N$50: R11.2 R12.2 U$37.G
N$51: LED6.A R24.1
N$52: LED6.C U$5.D U$6.P$2 U$7.A
N$53: R31.2 R32.2 U$8.G
N$55: LED7.C U$8.D U$9.P$2 U$10.A
N$56: LED7.A R33.1
N$57: R34.2 R35.2 U$11.G
N$58: BUZZER.- U$37.D U$38.A
N$59: LED8.C U$11.D U$12.P$2 U$13.A
N$60: LED8.A R36.1
N$61: R37.2 R38.2 U$14.G
N$63: LED9.C U$14.D U$15.P$2 U$16.A
N$64: LED9.A R39.1
N$65: R40.2 R41.2 U$17.G
N$67: LED10.C U$17.D U$18.P$2 U$19.A
N$68: LED13.A R52.1
N$69: R43.2 R44.2 U$20.G
N$71: LED11.C U$20.D U$21.P$2 U$22.A
N$72: LED12.A R49.1
N$73: R47.2 R48.2 U$23.G
N$75: LED12.C U$23.D U$24.P$2 U$25.A
N$76: LED11.A R46.1
N$77: R50.2 R51.2 U$26.G
N$79: LED13.C U$26.D U$27.P$2 U$28.A
N$80: LED10.A R42.1
N$81: R53.2 R54.2 U$29.G
N$83: LED14.C U$29.D U$30.P$2 U$31.A
N$84: LED14.A R55.1
N$85: R56.2 R57.2 U$32.G
N$87: LED15.C U$32.D U$33.P$2 U$34.A
N$88: LED15.A R58.1
OP-1S: R3.1 ; also sheet 3
OP-2S: R31.1 ; also sheet 3
OP-3S: R34.1 ; also sheet 3
OP-4S: R37.1 ; also sheet 3
OP-5S: R40.1 ; also sheet 3
OP-6S: R43.1 ; also sheet 3
OP-7S: R47.1 ; also sheet 3
OP-8S: R50.1 ; also sheet 3
OP-9S: R53.1 ; also sheet 3
OP-10S: R56.1 ; also sheet 3

## Power pins joined to a net without a drawn wire
GND: V1.7(/-UB:-UB) V2.7(/-UB:-UB) V3.7(/-UB:-UB)
VCC: V1.14(/+UB:+UB) V2.14(/+UB:+UB) V3.14(/+UB:+UB)

## Library data of the parts
4-NMOS 4-NMOS1 = Shell2013:DIL14: Dual In Line / Socket
BUZZER = Shell2013:BUZZER-CT-1212CL-SMT
C1-C10 C18 C22-C25 = SparkFun:CAP: Capacitor Standard 0603 ceramic capacitor, and 0.1" leaded capacitor.
C11 C15 C19 C20 = SparkFun-Capacitors:CAP_POL: Capacitor Polarized These are standard SMD and PTH capacitors. Normally 10uF, 47uF, and 100uF in electrolytic and tantalum varieties. Always verify the external diameter of the through hole cap, it varies with capacity, voltage, and manufacturer. The EIA devices should be standard.
C12-C14 C16 C17 C21 = SparkFun-Capacitors:CAP: Capacitor Standard 0603 ceramic capacitor, and 0.1" leaded capacitor.
CAN-EXP FAN1 FAN2 = con-molex:C-GRID-04: CONNECTOR wire to board 2.54 mm (0.100") pitch header; OC_FARNELL: unknown; OC_NEWARK: unknown
CAPCON/VOLT CAPCURR FCCON/VOLT FCCURR = con-amp:1445055-3: Micro MATE-N-LOK Connectors grid 1.5 mm Source: ENG_CD_1445055_A.pdf
D0 D1-D3 LED1 LED6-LED15 LERROR LRUN LSTART LSTOP = SparkFun:LED: LEDs Standard schematic elements and footprints for 5mm, 3mm, 1206, and 0603 sized LEDs. 5mm - Spark Fun Electronics SKU : COM-00529 (and others)
EXT-LEDS = con-molex:C-GRID-06: CONNECTOR wire to board 2.54 mm (0.100") pitch header; OC_FARNELL: unknown; OC_NEWARK: unknown
FCPRES TANKPRES = con-amp:1445055-4: Micro MATE-N-LOK Connectors grid 1.5 mm Source: ENG_CD_1445055_A.pdf
JP1 JP3 = SparkFun:JUMPER-3
JP2 = SparkFun-Connectors:USB: USB Connectors USB-B-PTH is fully proven SKU : PRT-00139/CONN-08278 USB-miniB is fully proven SKU : PRT-00587 USB-A-PCB is untested. USB-A-H is throughly reviewed, but untested. Spark Fun Electronics SKU : PRT-00437 USB-B-SMT is throughly reviewed, but untested. Needs silkscreen touching up. USB-A-S has not been used/tested USB-MB-H has not been used/tested USB-MICROB has been used. CONN-09505; PROD_ID: CONN-09505
JP4 = SparkFun:JUMPER-2: Jumper Basic 0.1" spaced jumper. Use with breakaway headers.
JTAG = avr-7:AVR-JTAG-10: AVR JTAG Debug/Programming Header
L1 = SparkFun:INDUCTOR: Inductors Basic Inductor/Choke - 0603 and 1206. Footprints are not proven and vary greatly between part numbers.
LD39300-NNP = v-reg:LD117A?*: Low drop fixed and adjustable positive voltage regulators 1 A Source: http://www.st.com/stonline/products/literature/ds/7194/ld1117axx.pdf
MCU = uniq-at32uc3c:AT32UC3C1: ATMEL 32-bit Microcontroller 64KB, 128KB, 256KB, 512KB 100-pin TQFP (81 GPIO pins) http://www.atmel.com/Images/32117s.pdf; FLASH: 512KB
POWER = pinhead:PINHD-2X8: PIN HEADER
PWR_12 = SparkFun-LED:LED: LEDs Standard schematic elements and footprints for 5mm, 3mm, 1206, and 0603 sized LEDs. 5mm - Spark Fun Electronics SKU : COM-00529 (and others)
R1-R6 R8 R11-R24 R29 R31-R67 R69 R71-R82 R87 R88 = SparkFun:RESISTOR: Resistor Basic schematic elements and footprints for 0603, 1206, and PTH resistors.
R7 R25 R26 R30 = SparkFun-Resistors:RESISTOR-ARRAY: Array Chip Resistor Source: RS Component / Phycomp
R9 R10 R27 R28 R68 R70 R89 = SparkFun:RESISTOR-ARRAY: Array Chip Resistor Source: RS Component / Phycomp
RESCON START SYS_OK U$6 U$9 U$12 U$15 U$18 U$21 U$24 U$27 U$30 U$33 = Shell2013:43650-0200
RESET = SparkFun-Electromechanical:SWITCH-MOMENTARY-2: Various NO switches- pushbuttons, reed, etc
SERVO1 SERVO2 = con-molex:C-GRID-03: CONNECTOR wire to board 2.54 mm (0.100") pitch header; OC_FARNELL: unknown; OC_NEWARK: unknown
THERMISTORS = Shell2013:PINHD-2X7: PIN HEADER
U$1 = Shell2013:2XETHERNET
U$2 U$3 = Shell2013:10X1PCBBLOCK
U$4 U$36 = Shell2013:MCP2551
U$5 U$8 U$11 U$14 U$17 U$20 U$23 U$26 U$29 U$32 U$35 U$37 U$39 = Shell2013:SIA426DJ
U$7 U$10 U$13 U$16 U$19 U$22 U$25 U$28 U$31 U$34 U$38 = diode:DIODE-: DIODE
V1-V3 = 74ttl-din:74*08: Quad 2-input AND gate